# EasyEDA Pro project ProPrj_USB Hub_2026-05-31.epro

# Schematic Schematic1
Board Name: Board1; Create Date: 2026-05-30; Page Name: P1; Project Name: USB Hub; Schematic Name: Schematic1; Update Date: 2026-05-30; Company: EasyEDA.com; Page Size: A4; Version: V1.0
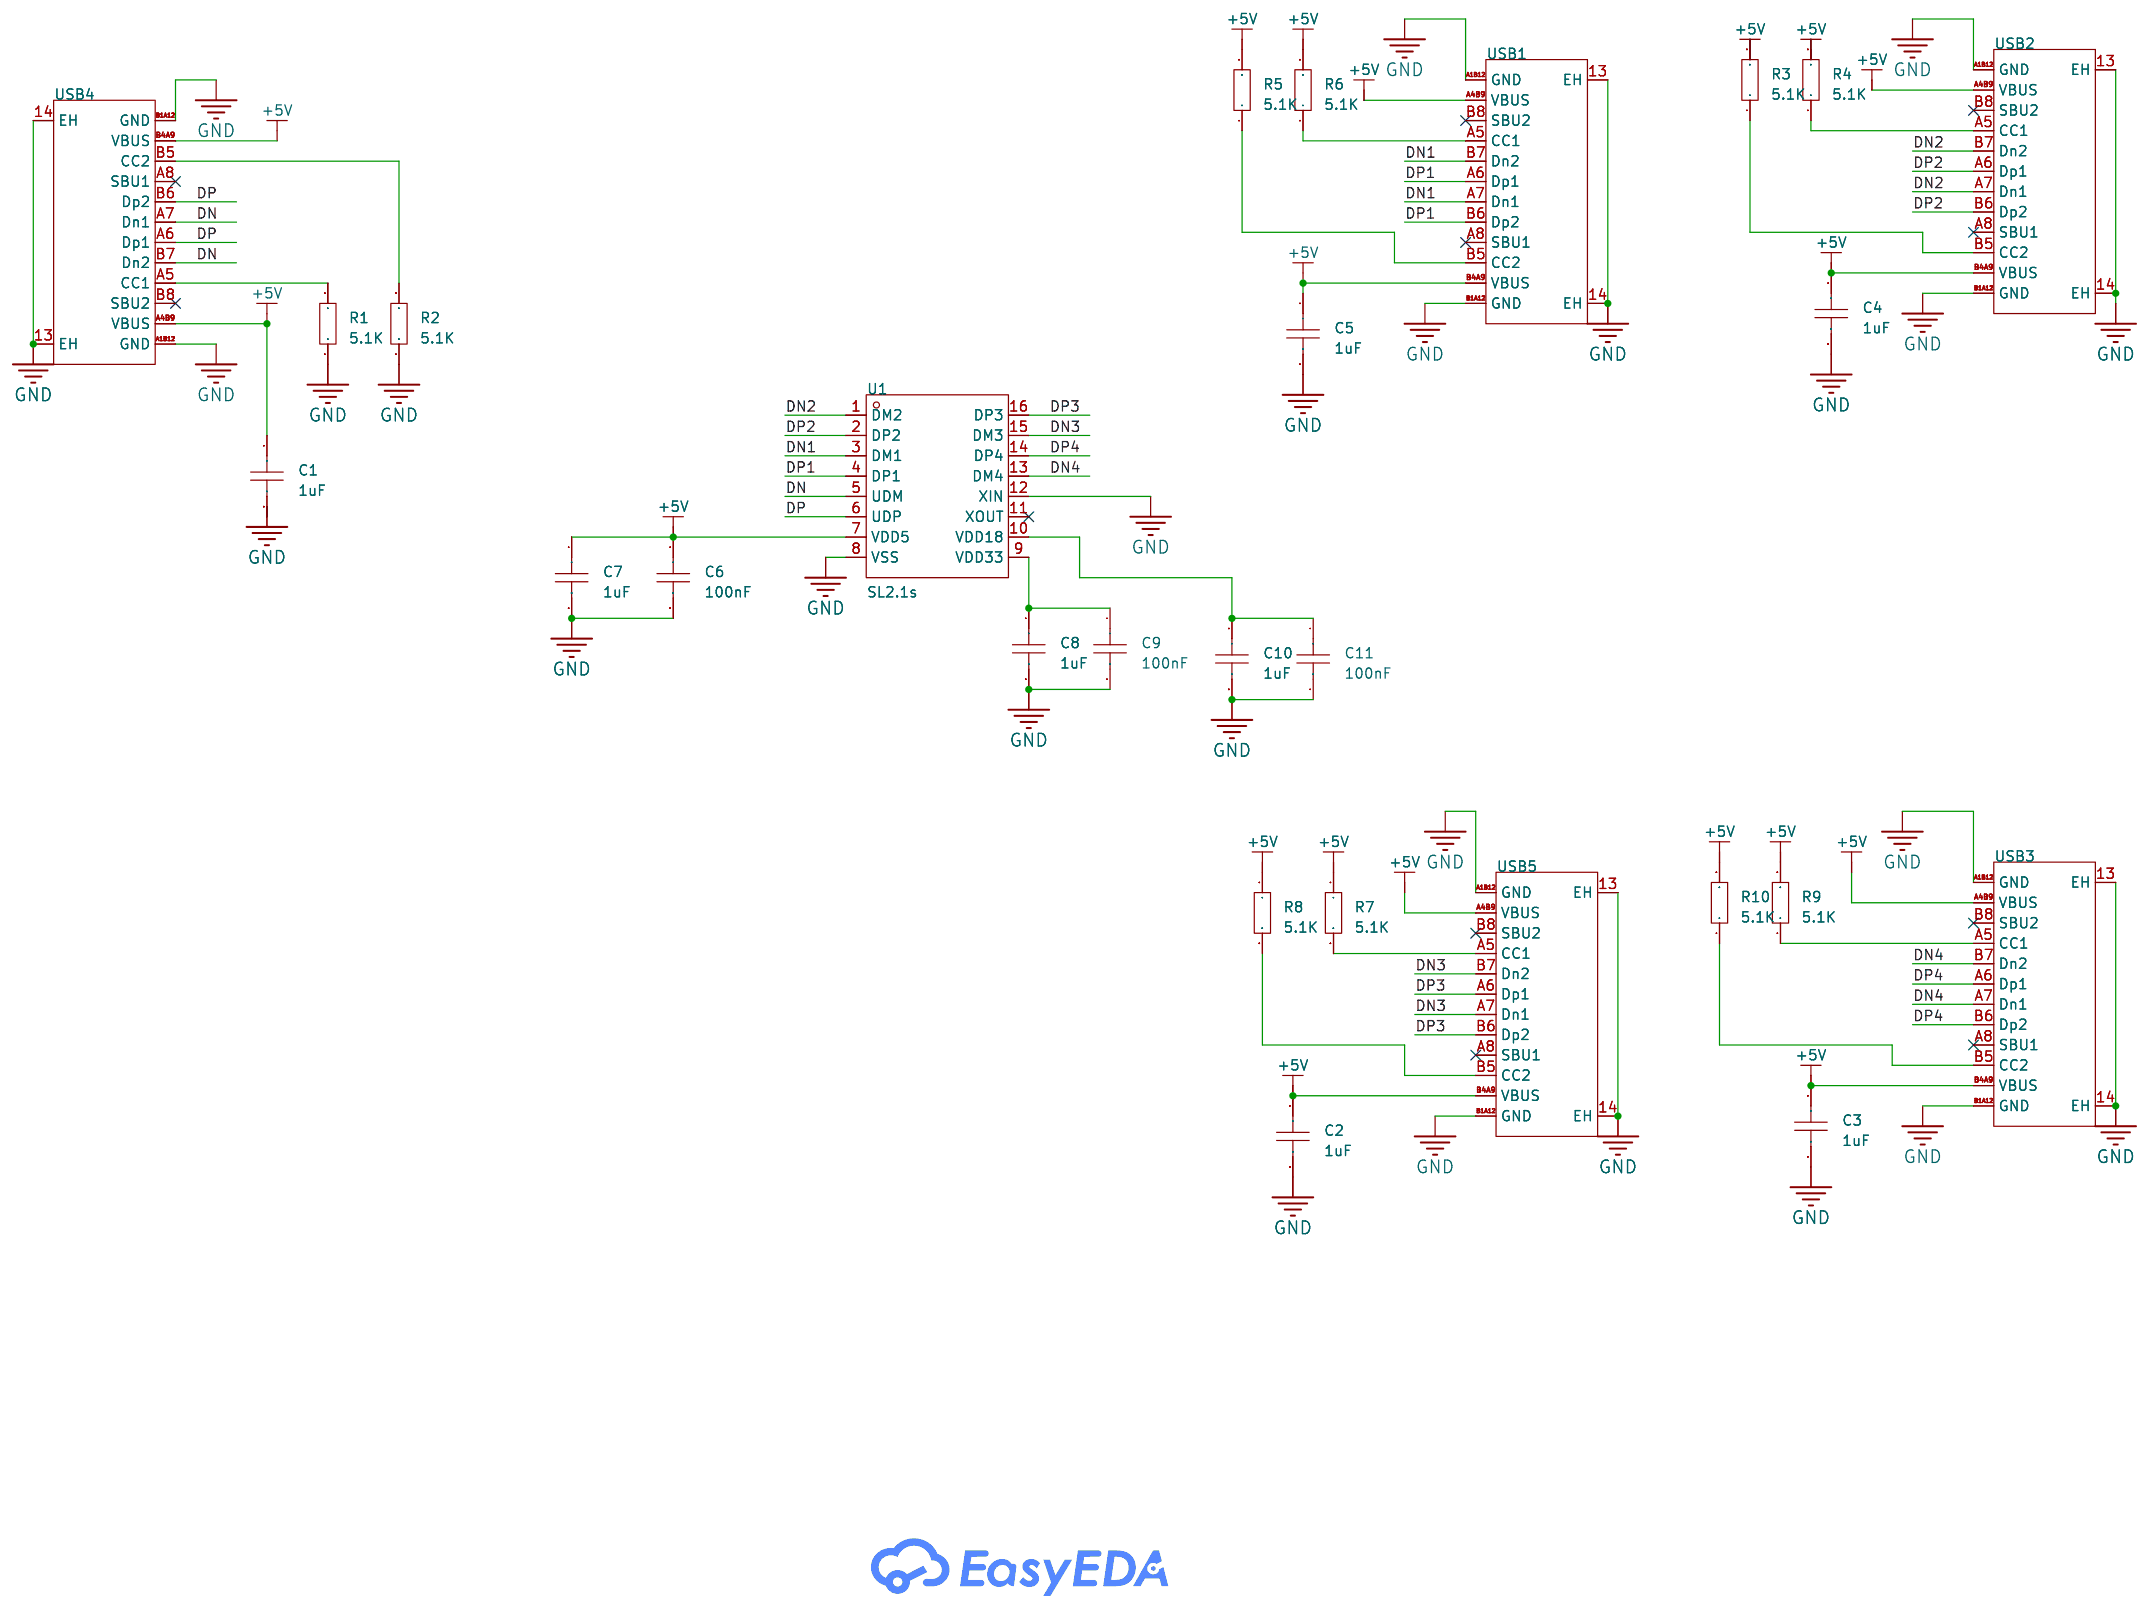
[diagram p0: schematic sheet]

## Parts
C1  1uF  [C0603]
C2  1uF  [C0603]
C3  1uF  [C0603]
C4  1uF  [C0603]
C5  1uF  [C0603]
C6  100nF  [C0603]
C7  1uF  [C0603]
C8  1uF  [C0603]
C9  100nF  [C0603]
C10  1uF  [C0603]
C11  100nF  [C0603]
R1  5.1K  [R0603]
R2  5.1K  [R0603]
R3  5.1K  [R0603]
R4  5.1K  [R0603]
R5  5.1K  [R0603]
R6  5.1K  [R0603]
R7  5.1K  [R0603]
R8  5.1K  [R0603]
R9  5.1K  [R0603]
R10  5.1K  [R0603]
U1  SL2.1s  [SSOP-16_L4.6-W2.6-P0.53-LS4.0-BL]
USB1  TYPE-C 16PIN 2MD(073)  [USB-C-SMD_TYPE-C-16PIN-2MD-073]
USB2  TYPE-C 16PIN 2MD(073)  [USB-C-SMD_TYPE-C-16PIN-2MD-073]
USB3  TYPE-C 16PIN 2MD(073)  [USB-C-SMD_TYPE-C-16PIN-2MD-073]
USB4  TYPE-C 16PIN 2MD(073)  [USB-C-SMD_TYPE-C-16PIN-2MD-073]
USB5  TYPE-C 16PIN 2MD(073)  [USB-C-SMD_TYPE-C-16PIN-2MD-073]

## Library data of the parts
C1-C11 = CAP_0603: Supplier Footprint: 0603
R1-R10 = Res_0603: Supplier Footprint: 0603
U1 = SL2.1s: type:Hub USB Protocol:USB 2.0 Data Rate:- Voltage - Supply:4V~5.25V Voltage - Supply:4V~5.25V Operating Temperature:0℃~+70℃ Operating Temperature:0℃~+70℃ Memory Interface:- Current - Supply:120mA Quiescent Supply Current:2.5mA Number of Channels:4; LCSC Part Name: USB2.0 HUB控制器集成电路; Supplier Part: C2684433; Manufacturer: CoreChips(和芯润德); Supplier Footprint: SSOP-16; JLCPCB Part Class: Extended Part; Datasheet: https://item.szlcsc.com/datasheet/SL2.1s/2782346.html; Supplier: LCSC; type: Hub; USB Protocol: USB 2.0; Voltage - Supply: 4V~5.25V; Operating Temperature: 0℃~+70℃; Current - Supply: 120mA; Quiescent Supply Current: 2.5mA; Number of Channels: 4
USB1-USB5 = TYPE-C 16PIN 2MD(073): Connector Type:Type-C Protocol Standard:- Gender:Female Mounting Type:Surface Mount, Right Angle Number of Contacts:16P Number of Ports:1 Current Rating-Power:3A Voltage Rating:5V Connect-Disconnect Life:10,000 Cycles Supplementary Features:- Center Heigh; LCSC Part Name: Type-C 母 卧贴; Supplier Part: C2765186; Manufacturer: SHOU HAN(首韩); Supplier Footprint: SMD; JLCPCB Part Class: Extended Part; Datasheet: https://item.szlcsc.com/datasheet/TYPE-C%252016PIN%25202MD(073)/2901843.html; Supplier: LCSC; Connector Type: Type-C; Gender: Female; Mounting Type: Surface Mount, Right Angle; Number of Contacts: 16P; Number of Ports: 1; Current Rating-Power: 3A; Voltage Rating: 5V; Connect-Disconnect Life: 10,000 Cycles; Detection color: Black; Operating Temperature: -25℃~+85℃

## Nets
+5V: C1.1 C2.1 C3.1 C4.1 C5.1 C6.1 C7.1 R3.2 R4.2 R5.2 R6.2 R7.1 R8.1 R9.2 R10.2 U1.7(VDD5) USB1.A4B9(VBUS) USB1.B4A9(VBUS) USB2.A4B9(VBUS) USB2.B4A9(VBUS) USB3.A4B9(VBUS) USB3.B4A9(VBUS) USB4.A4B9(VBUS) USB4.B4A9(VBUS) USB5.A4B9(VBUS) USB5.B4A9(VBUS)
GND: C1.2 C2.2 C3.2 C4.2 C5.2 C6.2 C7.2 C8.2 C9.2 C10.2 C11.2 R1.1 R2.1 U1.8(VSS) U1.12(XIN) USB1.13(EH) USB1.14(EH) USB1.A1B12(GND) USB1.B1A12(GND) USB2.13(EH) USB2.14(EH) USB2.A1B12(GND) USB2.B1A12(GND) USB3.13(EH) USB3.14(EH) USB3.A1B12(GND) USB3.B1A12(GND) USB4.13(EH) USB4.14(EH) USB4.A1B12(GND) USB4.B1A12(GND) USB5.13(EH) USB5.14(EH) USB5.A1B12(GND) USB5.B1A12(GND)
DN: U1.5(UDM) USB4.A7(Dn1) USB4.B7(Dn2)
DN1: U1.3(DM1) USB1.A7(Dn1) USB1.B7(Dn2)
DN2: U1.1(DM2) USB2.A7(Dn1) USB2.B7(Dn2)
DN3: U1.15(DM3) USB5.A7(Dn1) USB5.B7(Dn2)
DN4: U1.13(DM4) USB3.A7(Dn1) USB3.B7(Dn2)
DP: U1.6(UDP) USB4.A6(Dp1) USB4.B6(Dp2)
DP1: U1.4(DP1) USB1.A6(Dp1) USB1.B6(Dp2)
DP2: U1.2(DP2) USB2.A6(Dp1) USB2.B6(Dp2)
DP3: U1.16(DP3) USB5.A6(Dp1) USB5.B6(Dp2)
DP4: U1.14(DP4) USB3.A6(Dp1) USB3.B6(Dp2)
$1N1606: R1.2 USB4.A5(CC1)
$1N1613: R2.2 USB4.B5(CC2)
$1N2395: R4.1 USB2.A5(CC1)
$1N2403: R3.1 USB2.B5(CC2)
$1N2465: R6.1 USB1.A5(CC1)
$1N2470: R5.1 USB1.B5(CC2)
$1N3045: R9.1 USB3.A5(CC1)
$1N3049: R10.1 USB3.B5(CC2)
$1N3749: C8.1 C9.1 U1.9(VDD33)
$1N3828: C10.1 C11.1 U1.10(VDD18)
Net-(R7-2): R7.2 USB5.A5(CC1)
Net-(R8-2): R8.2 USB5.B5(CC2)

Not connected (* = marked no-connect by the designer): U1 11(XOUT)*; USB1 A8(SBU1)* B8(SBU2)*; USB2 A8(SBU1)* B8(SBU2)*; USB3 A8(SBU1)* B8(SBU2)*; USB4 A8(SBU1)* B8(SBU2)*; USB5 A8(SBU1)* B8(SBU2)*

# Board PCB1
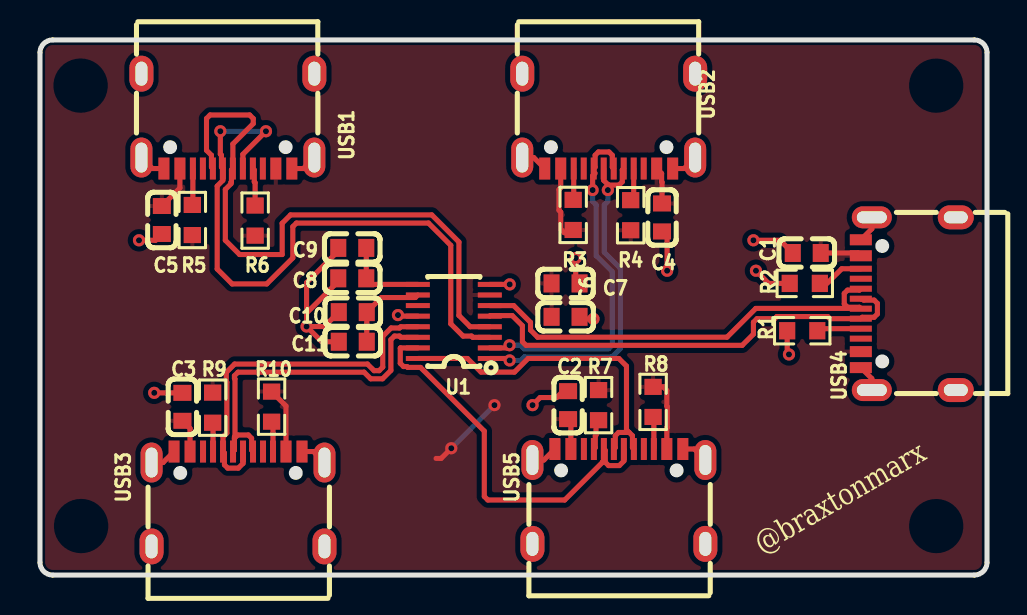
[diagram p1: board, top side]
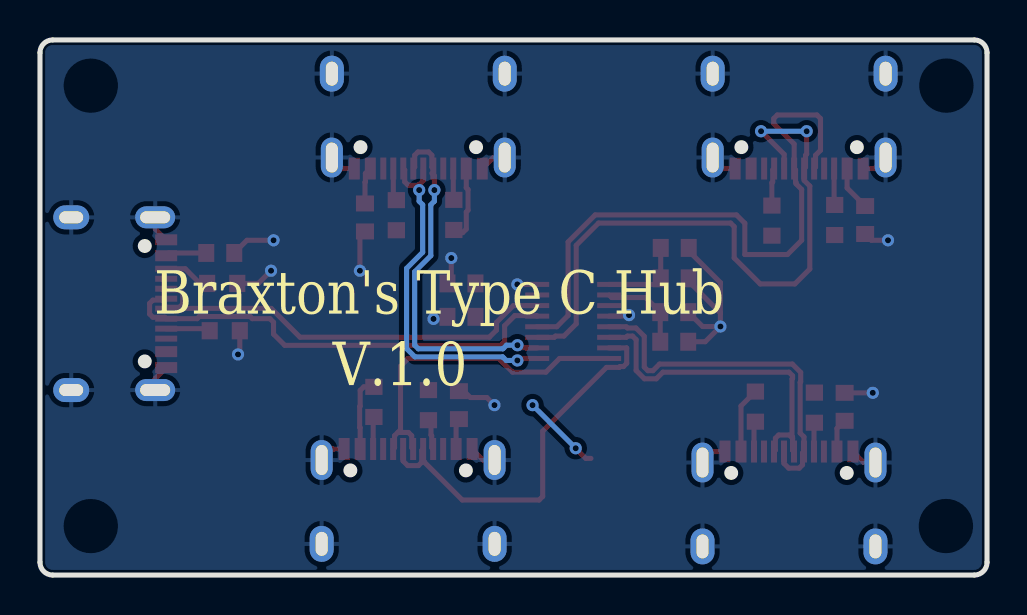
[diagram p2: board, bottom side, seen from below]

Outline 47.37 x 26.8 mm; copper layers: Top Layer, Bottom Layer. Coordinates in mm from the lower left corner of the outline.
Outline path: 0,26.16 0,0.63 arc(0.19,0.19) 0.64,0 46.74,0 arc(47.19,0.19) 47.37,0.63 47.37,26.16 arc(47.19,26.61) 46.74,26.8 0.64,26.8 arc(0.19,26.61) 0,26.16
Stack: Top Layer 0.035mm / Dielectric1 1.51mm FR4 er 4.5 / Bottom Layer 0.035mm

## Design rules (mm)
net DN2: DP4
net DP2: DP4
net DN1: DP5
net DP1: DP5
net DN: DP1
net DP: DP1
net DN4: DP3
net DP4: DP3
net DN3: DP2
net DP3: DP2
template: Custom Config
spacing copperThickness1oz (default): track to track 0.102, other pairs 0.152 to 0.3
spacing copperThickness2oz: track to track 0.203, other pairs 0.152 to 0.3
track width copperThickness1oz (default): min 0.127, default 0.254, max 2.54
track width copperThickness2oz: min 0.203, default 0.254, max 2.54
differential pair differentialPair (default): width min 0.127, default 0.254, max 2.54; gap min 0.152, default 0.152
via viaSize (default): diameter min 0.5, default 0.61, max 10; hole min 0.3, default 0.305, max 6.3

## Placement (name value [footprint] x y rotation side)
C1  1uF  [C0603]  38.35 16.13 180 top
C2  1uF  [C0603]  26.42 8.51 90 top
C3  1uF  [C0603]  7.12 8.42 90 top
C4  1uF  [C0603]  31.11 17.91 270 top
C5  1uF  [C0603]  6.1 17.78 270 top
C6  100nF  [C0603]  26.29 12.93 0 top
C7  1uF  [C0603]  26.29 14.6 0 top
C8  1uF  [C0603]  15.62 14.86 180 top
C9  100nF  [C0603]  15.62 16.38 180 top
C10  1uF  [C0603]  15.65 13.17 180 top
C11  100nF  [C0603]  15.65 11.68 180 top
R1  5.1K  [R0603]  38.13 12.23 0 top
R2  5.1K  [R0603]  38.26 14.6 0 top
R3  5.1K  [R0603]  26.67 18.03 270 top
R4  5.1K  [R0603]  29.55 18.02 270 top
R5  5.1K  [R0603]  7.62 17.78 270 top
R6  5.1K  [R0603]  10.76 17.75 270 top
R7  5.1K  [R0603]  27.94 8.51 90 top
R8  5.1K  [R0603]  30.67 8.67 90 top
R9  5.1K  [R0603]  8.64 8.38 90 top
R10  5.1K  [R0603]  11.58 8.43 90 top
U1  SL2.1s  [SSOP-16_L4.6-W2.6-P0.53-LS4.0-BL]  20.7 12.7 90 top
USB1  TYPE-C 16PIN 2MD(073)  [USB-C-SMD_TYPE-C-16PIN-2MD-073]  9.4 22.73 180 top
USB2  TYPE-C 16PIN 2MD(073)  [USB-C-SMD_TYPE-C-16PIN-2MD-073]  28.45 22.73 180 top
USB3  TYPE-C 16PIN 2MD(073)  [USB-C-SMD_TYPE-C-16PIN-2MD-073]  9.91 3.81 0 top
USB4  TYPE-C 16PIN 2MD(073)  [USB-C-SMD_TYPE-C-16PIN-2MD-073]  43.43 13.59 90 top
USB5  TYPE-C 16PIN 2MD(073)  [USB-C-SMD_TYPE-C-16PIN-2MD-073]  28.96 3.94 0 top

## Footprints (pads in the part's own frame, mm; a bottom-side part is the same pattern mirrored in y, then rotated)
C0603
  rect 0.8x0.9 smd: 1(-0.7,0) 2(0.7,0)
R0603
  rect 0.806x0.864 smd: 1(-0.753,0) 2(0.753,0)
SSOP-16_L4.6-W2.6-P0.53-LS4.0-BL
  rect 0.25x1.2 smd: 1(-1.855,-1.8) 2(-1.325,-1.8) 3(-0.795,-1.8) 4(-0.265,-1.8) 5(0.265,-1.8) 6(0.795,-1.8) 7(1.325,-1.8) 8(1.855,-1.8) 9(1.855,1.8) 10(1.325,1.8) 11(0.795,1.8) 12(0.265,1.8) 13(-0.265,1.8) 14(-0.795,1.8) 15(-1.325,1.8) 16(-1.855,1.8)
USB-C-SMD_TYPE-C-16PIN-2MD-073
  oval 1.1x2 hole 0.6x1.5: 13(-4.325,1.825) 14(4.325,1.825)
  oval 1.2x1.8 hole 0.6x1.2: 13(-4.325,-2.375) 14(4.325,-2.375)
  rect 0.55x1.1 smd: A1B12(-3.2,2.375) A4B9(-2.4,2.375) B1A12(3.2,2.375) B4A9(2.4,2.375)
  rect 0.3x1.1 smd: A5(-1.25,2.375) A6(-0.25,2.375) A7(0.25,2.375) A8(1.25,2.375) B5(1.75,2.375) B6(0.75,2.375) B7(-0.75,2.375) B8(-1.75,2.375)

## Nets
As in the schematic, except:
+5V: C1.1 C2.1 C3.1 C4.1 C5.1 C6.1 C7.1 R3.2 R4.2 R5.2 R6.2 R7.2 R8.2 R9.2 R10.2 U1.7 USB1.A4B9 USB1.B4A9 USB2.A4B9 USB2.B4A9 USB3.A4B9 USB3.B4A9 USB4.A4B9 USB4.B4A9 USB5.A4B9 USB5.B4A9
$1N2831: R8.1 USB5.B5
$1N2844: R7.1 USB5.A5

Pads without a net: U1 11; USB1 A8 B8; USB2 A8 B8; USB3 A8 B8; USB4 A8 B8; USB5 A8 B8

## Via types
v1: diameter 0.61, hole 0.305, Top Layer to Bottom Layer, 20 vias

## Routing (per net, layer and track width the routed paths; a pad name or vN(x,y) marks a point on that pad's centre or on a via; arc(x,y) is an arc through that point)
+5V: length 24.5
  Top Layer w0.254: USB1.B4A9 7,19.38 6.1,18.48 ; v1(20.57,6.35) 20.07,5.84 19.81,5.84 ; 39.05,16.13 40.92,16.13 USB4.B4A9 ; USB2.B4A9 26.05,19.39 25.96,19.31 25.96,18.27 26.05,18.18 26.05,17.32 26.23,17.14 26.53,17.14 R3.2 ; R10.2 12.31,8.47 USB3.B4A9 ; USB2.A4B9 31.09,20.11 31.09,19.69 31.11,19.67 C4.1 ; USB5.B4A9 31.36,7.38 31.38,7.4 31.38,8.44 31.36,8.46 31.36,9.24 31.18,9.42 30.67,9.42 ; 26.29,7.94 26.29,7.75 26.56,7.48 USB5.A4B9 ; 7.51,6.19 7.51,7.34 C3.1
  Bottom Layer w0.254: v1(22.73,8.51) v1(20.57,6.35)
GND: length 40.3
  Top Layer w0.254: USB1.A1B12 13.17,20.36 USB1.13 ; USB2.B1A12 24.7,20.91 USB2.14 ; USB1.14 5.62,20.36 USB1.B1A12 ; v1(26.8,15.88) 26.8,14.8 C7.2 ; C4.2 31.37,16.95 v1(31.37,15.24) ; v1(37.47,11.05) 37.38,11.14 R1.1 ; 26.29,9.34 25.84,8.89 25.02,8.89 v1(24.64,8.51) ; C11.2 14.1,11.68 v1(13.33,12.45) ; 6.71,6.19 6.16,5.63 USB3.13 ; U1.8 v1(23.5,14.55) ; v1(13.33,12.45) 14.23,12.45 C10.2 ; v1(13.33,12.45) 13.33,13.12 ; USB4.14 41.61,17.34 USB4.B1A12 ; 13.33,13.12 13.33,14.64 14.95,16.26 ; 13.33,13.12 14.95,14.73 ; USB2.A1B12 32.22,20.36 USB2.13 ; C6.2 27.09,12.83 v1(27.69,12.83) ; USB5.14 32.73,6.31 USB5.B1A12 ; USB5.A1B12 25.21,5.76 USB5.13 ; USB4.13 41.61,9.84 USB4.A1B12 ; v1(35.81,15.24) 36.45,14.6 R2.1 ; C5.2 5.78,16.76 v1(4.95,16.76) ; U1.12 17.91,12.97 ; 13.11,6.19 13.68,6.19 USB3.14 ; C1.2 37.02,16.76 v1(35.69,16.76) ; C3.2 v1(5.72,9.12)
  vias: v1(17.91,13.02)
DN: length 23
  Top Layer w0.254: U1.5 22.53,12.99 23.62,12.99 24.13,12.48 24.13,11.68 24.31,11.5 35.13,11.5 35.69,12.06 35.69,12.66 35.87,12.84 36.75,12.84 36.86,12.95 39.4,12.95 39.51,12.84 USB4.B7 41.13,12.91 41.72,12.91 41.89,13.07 41.89,13.6 41.72,13.77 41.2,13.77 41.16,13.82 41.08,13.82 USB4.A7
DN1: length 32.5
  Top Layer w0.254: v1(9.02,22.22) 9.02,21.08 9.08,21.02 9.08,20.43 USB1.A7 9.15,19.76 8.86,19.48 8.86,15.33 9.61,14.58 11.34,14.58 12.65,15.88 12.65,17.45 12.83,17.63 19.43,17.63 20.55,16.51 20.55,12.58 21.16,11.97 21.59,11.97 21.65,11.91 U1.3 ; USB1.B7 10.15,21.07 v1(11.3,22.22)
  Bottom Layer w0.254: v1(9.02,22.22) v1(11.3,22.22)
DN2: length 17.8
  Top Layer w0.254: U1.1 23.39,10.84 v1(23.49,10.75) ; USB2.B7 29.13,20.29 29.13,19.69 28.96,19.53 28.43,19.53 28.41,19.56 ; 28.41,19.56 28.2,19.76 USB2.A7 ; 28.41,19.56 v1(28.41,19.28)
  Bottom Layer w0.254: v1(28.41,19.28) 28.41,18.72 28.23,18.54 28.23,16.16 29.03,15.36 29.03,11.34 28.62,10.92 24.23,10.92 24.05,10.75 v1(23.49,10.75)
DN3: length 20.4
  Top Layer w0.254: USB5.A7 29.21,6.31 29.21,5.72 28.98,5.48 28.44,5.48 28.28,5.65 28.28,6.24 USB5.B7 28.21,5.73 28.14,5.66 28.14,5.65 26.25,3.76 22.4,3.76 22.23,3.94 22.23,7.21 19.04,10.4 18.4,10.4 18.36,10.44 18.19,10.44 18.02,10.6 18.02,11.36 18.03,11.38 U1.15
DN4: length 17.6
  Top Layer w0.254: U1.13 18.05,12.44 17.98,12.37 17.56,12.37 17.14,11.96 17.14,10.41 16.97,10.23 16.71,10.23 16.38,10.57 9.74,10.57 9.32,10.15 9.32,9.68 9.35,9.65 9.35,7.11 9.16,6.92 USB3.B7 9.23,6.11 9.23,5.52 9.39,5.36 9.92,5.36 10.15,5.59 10.16,5.59
DP: length 22.4
  Top Layer w0.254: 41.05,13.35 USB4.A6 ; 41.05,13.35 35.8,13.35 34.36,11.91 24.89,11.91 24.54,12.27 24.54,12.65 23.69,13.49 U1.6 ; 41.05,13.35 40.99,13.41 40.39,13.41 40.23,13.57 40.23,14.1 40.39,14.27 40.99,14.27 USB4.B6
DP1: length 31.5
  Top Layer w0.254: USB1.B6 8.58,20.43 8.58,21.02 8.33,21.27 8.33,22.86 8.51,23.04 10.49,23.04 10.67,22.86 10.67,22.61 9.65,21.59 USB1.A6 9.58,20.29 9.58,19.69 9.55,19.67 9.55,19.59 9.27,19.31 9.27,16.76 9.98,16.05 12.11,16.05 12.11,17.62 12.53,18.03 19.6,18.03 20.95,16.68 20.95,13 21.52,12.44 U1.4
DP2: length 17.8
  Top Layer w0.254: v1(23.49,11.51) 23.36,11.38 U1.2 ; USB2.B6 27.77,20.43 27.77,21.02 27.93,21.19 28.46,21.19 28.63,21.02 28.63,20.43 USB2.A6 ; 27.77,20.12 27.64,19.99 v1(27.64,19.28)
  Bottom Layer w0.254: v1(23.49,11.51) 24.04,11.51 24.21,11.33 28.45,11.33 28.63,11.51 28.63,15.19 27.82,15.99 27.82,18.54 27.64,18.72 v1(27.64,19.28)
DP3: length 16.9
  Top Layer w0.254: 29.47,7.14 28.94,7.14 28.78,6.98 28.78,6.38 USB5.A6 ; USB5.B6 29.64,6.38 29.64,6.98 29.34,7.28 29.34,10.46 28.96,10.84 24.42,10.84 23.73,10.16 22.06,10.16 21.38,10.84 U1.16
DP4: length 17.3
  Top Layer w0.254: 9.73,6.26 9.73,6.91 9.75,6.94 9.75,9.82 9.73,9.85 9.73,9.98 9.91,10.16 16.21,10.16 16.54,9.83 17.13,9.83 17.55,10.25 17.55,11.79 17.73,11.97 17.98,11.97 18.05,11.91 U1.14 ; 9.73,6.26 9.73,6.85 9.89,7.01 10.42,7.01 10.58,6.85 10.58,6.26 USB3.B6 ; 9.73,6.26 USB3.A6
$1N1606: length 2.2
  Top Layer w0.254: USB4.A5 38.99,12.34 R1.2
$1N1613: length 2
  Top Layer w0.254: USB4.B5 40.1,15.34 39.37,14.6
$1N2395: length 1.6
  Top Layer w0.254: R4.1 29.7,18.93 USB2.A5
$1N2403: length 1.6
  Top Layer w0.254: USB2.B5 26.7,18.81 R3.1
$1N2465: length 1.9
  Top Layer w0.254: R6.1 10.76,19.65 10.72,19.69 10.72,20.29 USB1.A5
$1N2470: length 1.8
  Top Layer w0.254: USB1.B5 7.65,18.56 R5.1
$1N2831: length 1.6
  Top Layer w0.254: USB5.B5 30.71,7.88 R8.1
$1N2844: length 1.6
  Top Layer w0.254: USB5.A5 27.78,6.38 27.78,6.98 27.81,7.01 27.81,7.88
$1N3045: length 1.5
  Top Layer w0.254: R9.1 8.66,7.61 USB3.A5
$1N3049: length 1.5
  Top Layer w0.254: R10.1 11.66,7.61 USB3.B5
$1N3749: length 4.2
  Top Layer w0.254: U1.9 16.63,14.55 C8.1 C9.1
$1N3828: length 4.4
  Top Layer w0.254: 16.35,11.68 16.35,13.17 17.08,13.9 18.77,13.9 U1.10

## Copper pours and planes (outline as drawn; the poured copper is in the pictures)
+5V on Top Layer: -2.67,30.48 49.53,30.48 49.53,-2.79 -2.67,-2.79
GND on Bottom Layer: -10.67,35.18 65.15,35.18 65.15,-10.67 -10.67,-10.67
GND on Bottom Layer: -9.27,28.45 51.69,28.45 51.69,-1.78 -9.27,-1.78

## Text on the board
Bottom Silkscreen Layer: Braxton's Type C Hub / V.1.0
Top Silkscreen Layer: @braxtonmarx
